# EAGLE design xbee-usb (EAGLE 7.5.0)
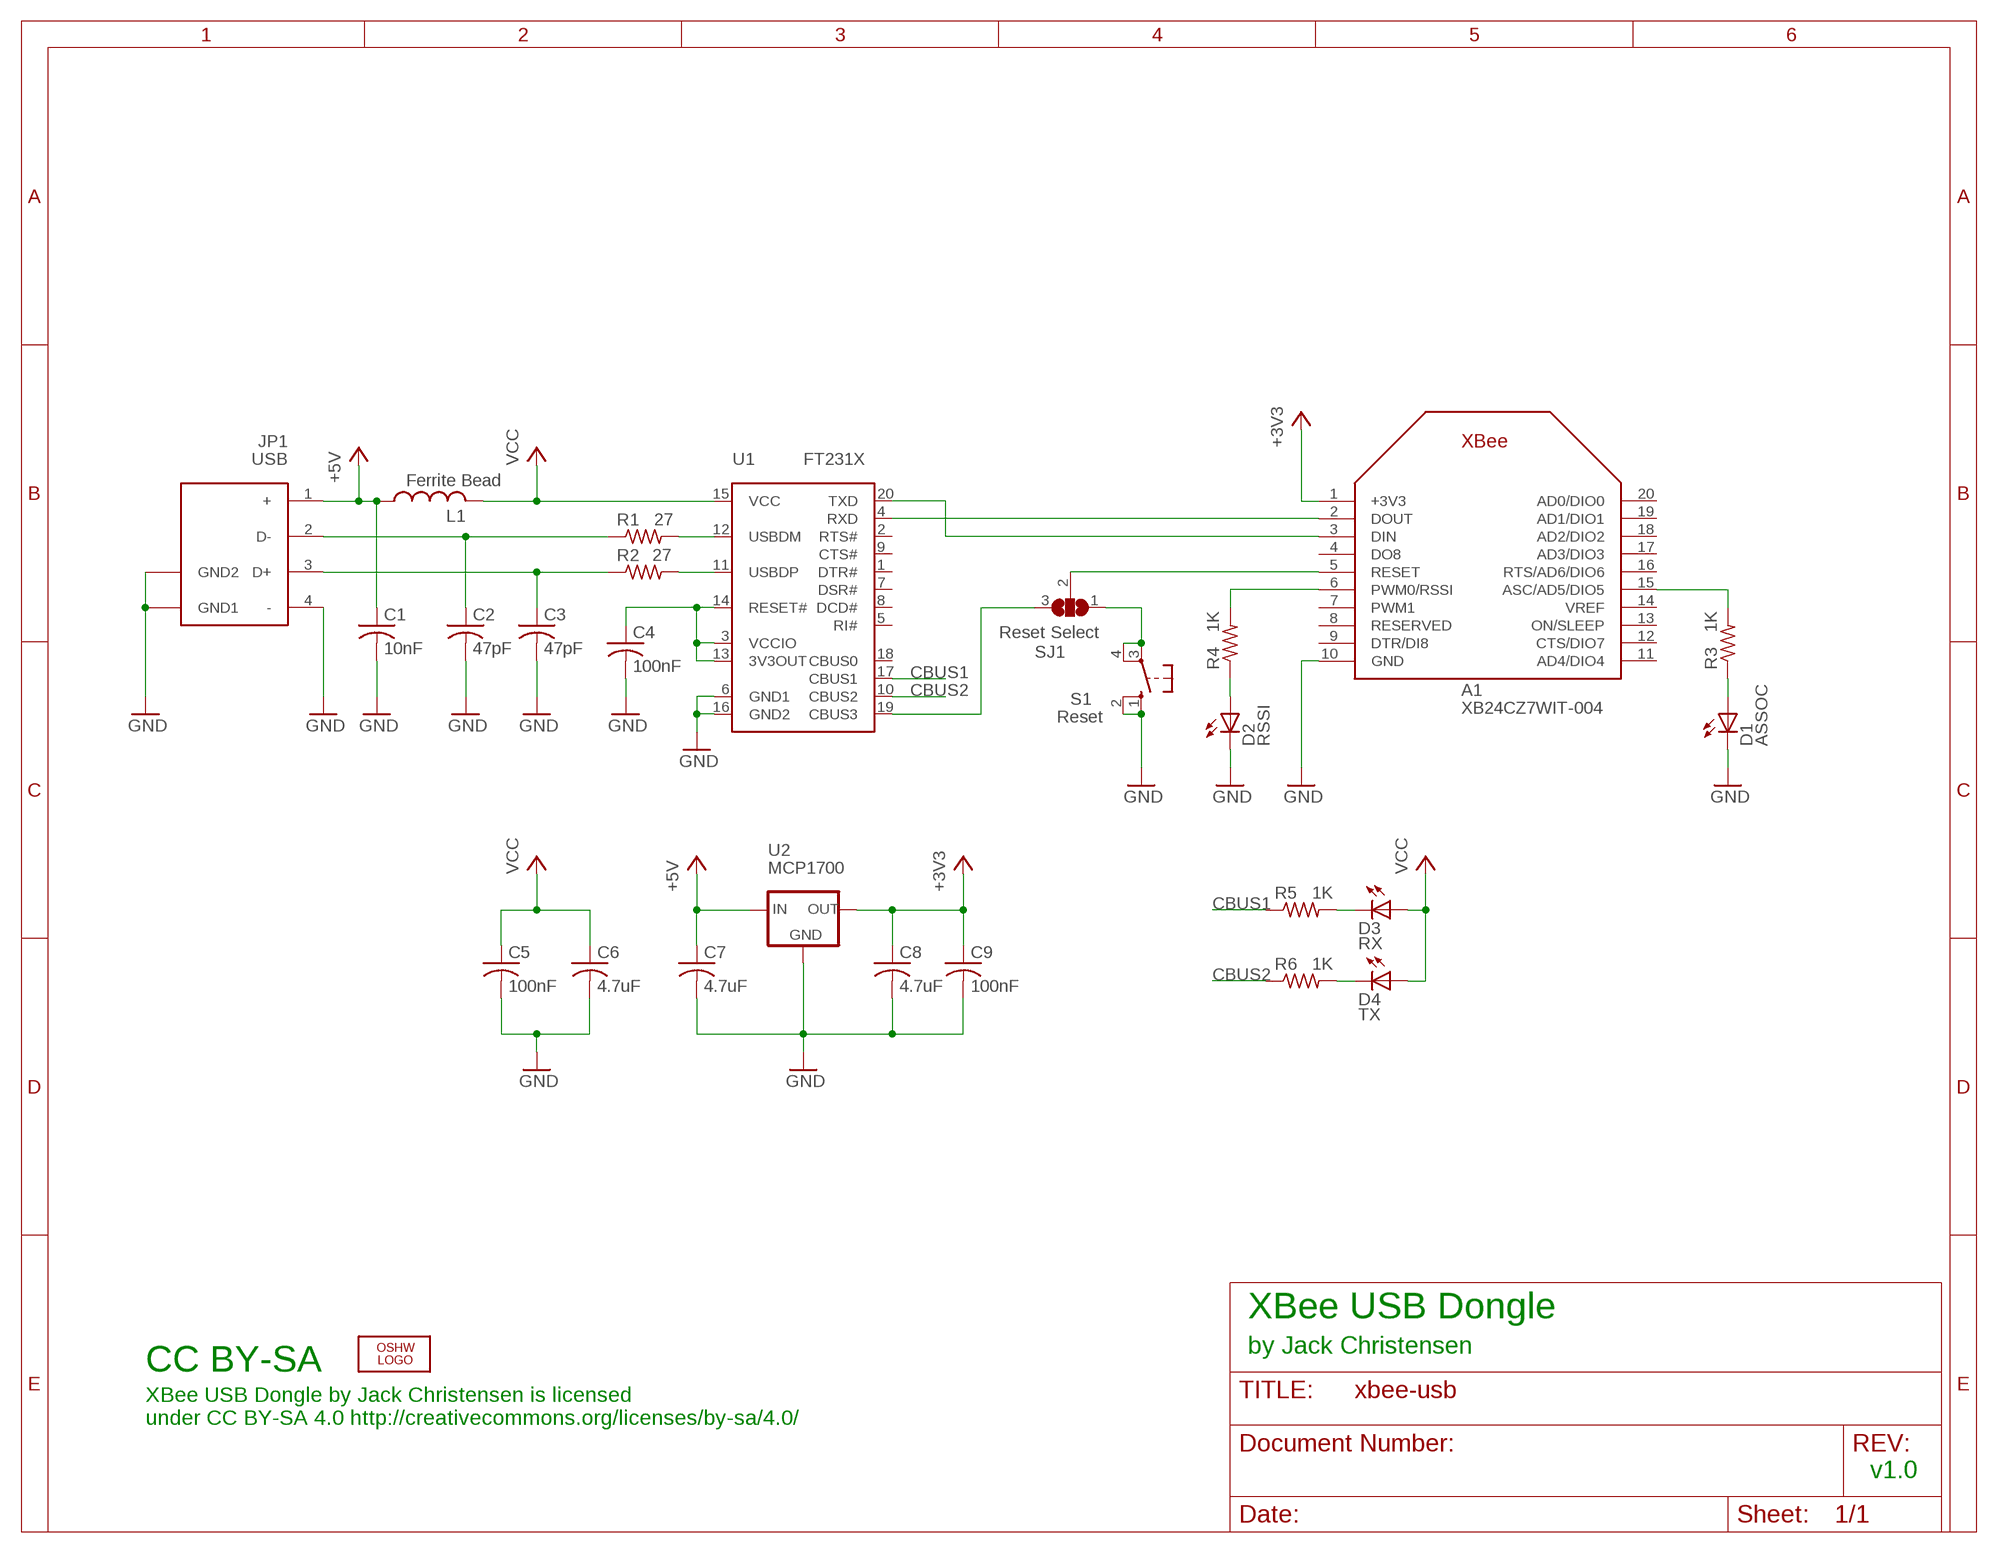
[diagram p0: schematic, sheet 1]

## Parts
A1  XB24CZ7WIT-004  ULINK_XBEEOVALPADS  [XBEE_OVAL_PADS]
C1  10nF  C-USM0805  [M0805]
C2  47pF  C-USM0805  [M0805]
C3  47pF  C-USM0805  [M0805]
C4  100nF  C-USM0805  [M0805]
C5  100nF  C-USM0805  [M0805]
C6  4.7uF  C-USM0805  [M0805]
C7  4.7uF  C-USM0805  [M0805]
C8  4.7uF  C-USM0805  [M0805]
C9  100nF  C-USM0805  [M0805]
D1  ASSOC  LEDD0805  [D0805]
D2  RSSI  LEDD0805A  [D0805A]
D3  RX  LEDD0805  [D0805]
D4  TX  LEDD0805A  [D0805A]
JP1  USB  UP2-AH-TH  [UP2-AH-X-TH]
L1  Ferrite Bead  INDUCTORM0805  [M0805]
LOGO1  OSHW_LOGO_8MILX0100-NT  [OSHW_8X100_NOTEXT]
R1  27  R-US_M0805  [M0805]
R2  27  R-US_M0805  [M0805]
R3  1K  R-US_M0805  [M0805]
R4  1K  R-US_M0805  [M0805]
R5  1K  R-US_M0805  [M0805]
R6  1K  R-US_M0805  [M0805]
S1  Reset  10-XXOCT  [B3F-10XXOCT]
SJ1  Reset Select  SJ2W  [SJ_2]
U1  FT231X  FT231XSSOP20-W  [SSOP20-W]
U2  MCP1700  MCP1700SOT23-W  [SOT23-W]

## Nets
+3V3: A1.1(+3V3) C8.1 C9.1 U2.2(OUT)
+5V: C1.1 C7.1 JP1.1(+) L1.1 U2.3(IN)
CBUS1: R5.1 U1.17(CBUS1)
CBUS2: R6.1 U1.10(CBUS2)
GND: A1.10(GND) C1.2 C2.2 C3.2 C4.2 C5.2 C6.2 C7.2 C8.2 C9.2 D1.K(C) D2.K(C) JP1.4(-) JP1.P$5(GND1) JP1.P$6(GND2) S1.1(S) S1.2(S1) U1.6(GND1) U1.16(GND2) U2.1(GND)
N$1: C2.1 JP1.2(D-) R1.1
N$2: C3.1 JP1.3(D+) R2.1
N$4: C4.1 U1.3(VCCIO) U1.13(3V3OUT) U1.14(RESET#)
N$5: R1.2 U1.12(USBDM)
N$6: R2.2 U1.11(USBDP)
N$7: A1.2(DOUT) U1.4(RXD)
N$8: A1.3(DIN) U1.20(TXD)
N$9: D3.K(C) R5.2
N$10: A1.5(RESET) SJ1.2
N$11: D2.A R4.1
N$12: D1.A R3.1
N$13: A1.6(PWM0/RSSI) R4.2
N$14: A1.15(ASC/AD5/DIO5) R3.2
N$15: D4.K(C) R6.2
N$16: S1.3(P) S1.4(P1) SJ1.1
N$19: SJ1.3 U1.19(CBUS3)
VCC: C5.1 C6.1 D3.A D4.A L1.2 U1.15(VCC)
Unconnected: A1.4(DO8) A1.7(PWM1) A1.8(RESERVED) A1.9(DTR/DI8) A1.11(AD4/DIO4) A1.12(CTS/DIO7) A1.13(ON/SLEEP) A1.14(VREF) A1.16(RTS/AD6/DIO6) A1.17(AD3/DIO3) A1.18(AD2/DIO2) A1.19(AD1/DIO1) A1.20(AD0/DIO0) U1.1(DTR#) U1.2(RTS#) U1.5(RI#) U1.7(DSR#) U1.8(DCD#) U1.9(CTS#) U1.18(CBUS0)

## Notes on the sheet
- XBee USB Dongle
- by Jack Christensen
- CC BY-SA
- XBee USB Dongle by Jack Christensen is licensed
  under CC BY-SA 4.0 http://creativecommons.org/licenses/by-sa/4.0/
- v1.0

## Library data of the parts
A1 = _jc:ULINK_XBEE
C1-C9 = _jc:C-US: CAPACITOR, American symbol
D1-D4 = _jc:LED: LED OSRAM: - CHIPLED LG R971, LG N971, LY N971, LG Q971, LY Q971, LO R971, LY R971 LH N974, LH R974 LS Q976, LO Q976, LY Q976 LO Q996 - Hyper CHIPLED LW Q18S LB Q993, LB Q99A, LB R99A - SideLED LS A670, LO A670, LY A670, LG A670, LP A670 LB A673, LV A673, LT A673, LW A673 LH A674 LY A675 LS A676, LA A676, LO A676, LY A676, LW A676 LS A679, LY A679, LG A679 - Hyper Micro SIDELED® LS Y876, LA Y876, LO Y876, LY Y876 LT Y87S - SmartLED LW L88C, LW L88S LB L89C, LB L89S, LG L890 LS L89K, LO L89K, LY L89K LS L896, LA L896, LO L896, LY L896 - TOPLED LS T670, LO T670, LY T670, LG T670, LP T670 LSG T670, LSP T670, LSY T670, LOP T670, LYG T670 LG T671, LOG T671, LSG T671 LB T673, LV T673, LT T673, LW T673 LH T674 LS T676, LA T676, LO T676, LY T676, LB T676, LH T676, LSB T676, LW T676 LB T67C, LV T67C, LT T67C, LS T67K, LO T67K, LY T67K, LW E67C LS E67B, LA E67B, LO E67B, LY E67B, LB E67C, LV E67C, LT E67C LW T67C LS T679, LY T679, LG T679 LS T770, LO T770, LY T770, LG T770, LP T770 LB T773, LV T773, LT T773, LW T773 LH T774 LS E675, LA E675, LY E675, LS T675 LS T776, LA T776, LO T776, LY T776, LB T776 LHGB T686 LT T68C, LB T68C - Hyper Mini TOPLED® LB M676 - Mini TOPLED Santana® LG M470 LS M47K, LO M47K, LY M47K Source: http://www.osram.convergy.de/
JP1 = _jc:UP2-AH-TH: CUI Inc. Series UP2-AH-TH Male USB plug.
L1 = _jc:INDUCTOR: Murata #11R472C
LOGO1 = ohw-logo:OSHW_LOGO_8MIL
R1-R6 = _jc:R-US_: RESISTOR, American symbol
S1 = _jc:10-XX: OMRON SWITCH
SJ1 = jumper:SJ2W: SMD solder JUMPER
U1 = _jc:FT231X: FTDI FT231X USB to Full Handshake UART IC
U2 = _jc:MCP1700: VOLTAGE REGULATOR

## Board
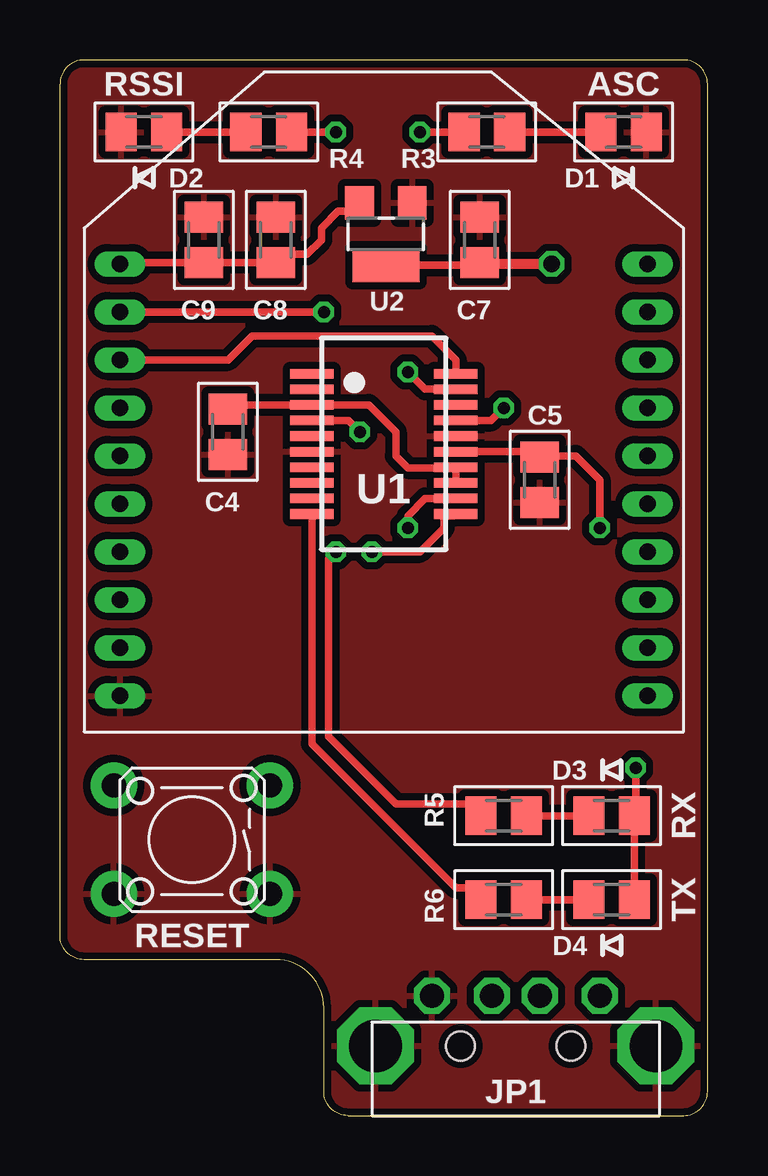
[diagram p1: board, top side]
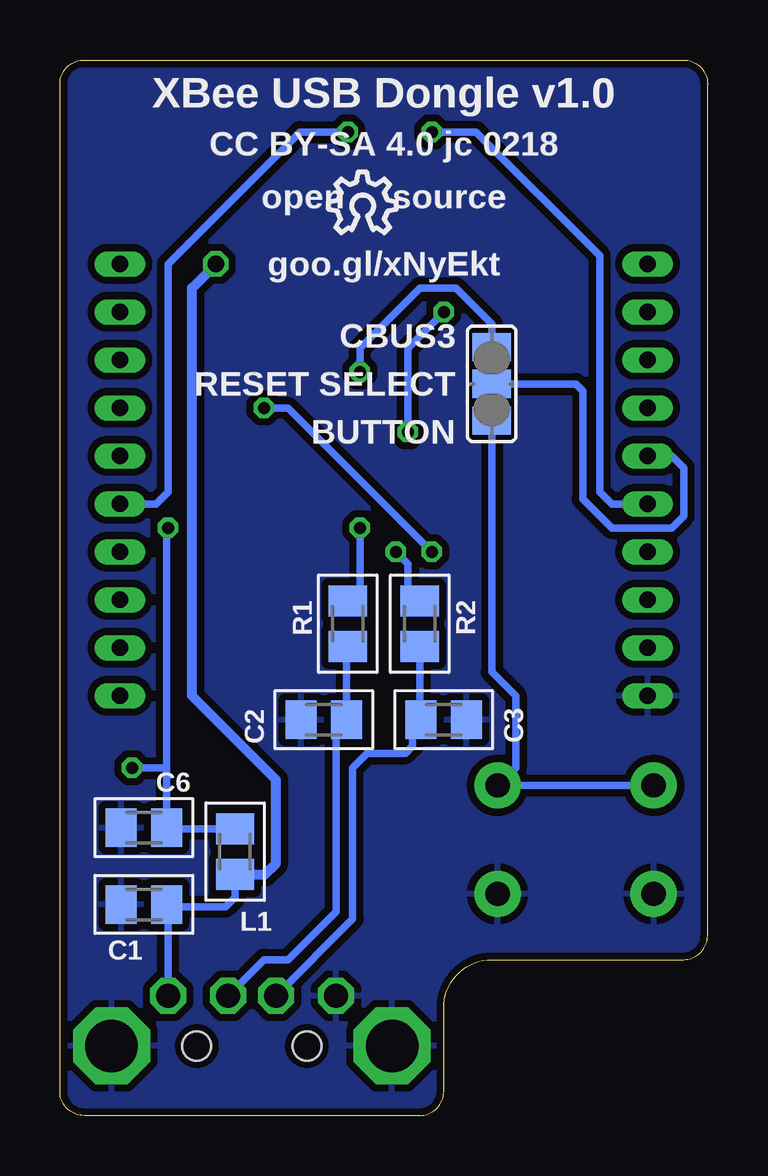
[diagram p2: board, bottom side, seen from below]

Size 27 x 44 mm. Coordinates in mm from the lower left corner, seen from the top.
Outline: 12,0 26,0 arc90 27,1 27,43 arc90 26,44 1,44 arc90 0,43 0,7.5 arc90 1,6.5 9,6.5 arc-90 11,4.5 11,1 arc90 12,0
Copper layers (1*16): Top 0.0356mm / dielectric 1.5011mm / Bottom 0.0356mm
Design rules "oshpark-2layer-jc": minimum track width 8mil, minimum drill 13mil, track to track 8mil, track to pad 8mil, pad to pad 8mil, via to via 8mil, smd to smd 6mil, copper to edge 12mil, drill to drill 6mil, minimum pad ring 7mil, minimum via ring 7mil, stop-mask expansion 2.5mil, vias tented up to drill 20mil, thermal gap 12mil

### Footprints (pad centres in the part's own frame; a part is rotated, then mirrored left to right if it is on the bottom)
XBEE_OVAL_PADS = drill 0.7 pad 1 long: 1 -11,5.5; 2 -11,3.5; 3 -11,1.5; 4 -11,-0.5; 5 -11,-2.5; 6 -11,-4.5; 7 -11,-6.5; 8 -11,-8.5; 9 -11,-10.5; 10 -11,-12.5; 11 11,-12.5; 12 11,-10.5; 13 11,-8.5; 14 11,-6.5; 15 11,-4.5; 16 11,-2.5; 17 11,-0.5; 18 11,1.5; 19 11,3.5; 20 11,5.5
M0805 = smd 1.3 x 1.6: 1 -0.95,0; 2 0.95,0
D0805 = smd 1.3 x 1.6: A -0.95,0; K 0.95,0
D0805A = smd 1.3 x 1.6: A -0.95,0; K 0.95,0
UP2-AH-X-TH = drill 1 octagon: 1 3.5,5; 2 1,5; 3 -1,5; 4 -3.5,5 | drill 2.2 octagon: P$5 5.85,2.9; P$6 -5.85,2.9 | hole 1.2: 2.3,2.9; -2.3,2.9
B3F-10XXOCT = drill 1.016 pad 1.93: 1 -3.251,2.261; 2 3.251,2.261; 3 -3.251,-2.261; 4 3.251,-2.261
SJ_2 = smd 1.168 x 1.6: 1 -1.524,0; 2 0,0; 3 1.524,0
SSOP20-W = smd 0.4 x 1.8: 1 -2.925,-3; 2 -2.275,-3; 3 -1.625,-3; 4 -0.975,-3; 5 -0.325,-3; 6 0.325,-3; 7 0.975,-3; 8 1.625,-3; 9 2.275,-3; 10 2.925,-3; 11 2.925,3; 12 2.275,3; 13 1.625,3; 14 0.975,3; 15 0.325,3; 16 -0.325,3; 17 -0.975,3; 18 -1.625,3; 19 -2.275,3; 20 -2.925,3
SOT23-W = smd 1.2 x 1.4: 1 -1.1,-1.3; 2 1.1,-1.3 | smd 2.8 x 1.4: 3 0,1.3

### Placement (x,y rotation side)
A1  13.5,30 0 top
C1  23.5,8.8 180 bottom
C2  16,16.5 180 bottom
C3  11,16.5 0 bottom
C4  7,28.5 270 top
C5  20,26.5 270 top
C6  23.5,12 180 bottom
C7  17.5,36.5 90 top
C8  9,36.5 90 top
C9  6,36.5 90 top
D1  23.5,41 0 top
D2  3.5,41 180 top
D3  23,12.5 180 top
D4  23,9 180 top
JP1  19,0 0 top
L1  19.7,11 90 bottom
LOGO1  15.8,36.8 0 bottom
R1  15,20.5 90 bottom
R2  12,20.5 90 bottom
R3  17.8,41 180 top
R4  8.7,41 0 top
R5  18.5,12.5 0 top
R6  18.5,9 0 top
S1  5.5,11.5 180 top
SJ1  9,30.5 90 bottom
U1  13.5,28 270 top
U2  13.59,36.75 180 top

### Tracks (layer width: path | path; a pad name or v marks a point on that pad's centre or on a via)
+3V3
  Top 0.305: U2.2 12.14,37.7 11.6,37.7 10.9,37 10.9,36.5 10.3,35.9 9.5,35.9 9.5,36 9.05,35.55 C8.1 C9.1 2.55,35.55 A1.1
+5V  (via drill 0.7)
  Top 0.305: U2.3 17.4,35.45 C7.1
  Top 0.406: v20.5,35.5 17.55,35.5 C7.1
  Bottom 0.305: JP1.1 22.5,8.75 C1.1 22.45,8.7 20.1,8.7 19.7,9.1 L1.1
  Bottom 0.406: L1.1 18.45,10.05 18,10.5 18,14 21.5,17.5 21.5,34.5 v20.5,35.5
CBUS1  (via drill 0.5)
  Top 0.305: U1.17 17.98,28.98 v18.5,29.5 | v11.5,23.5 11.2,23.2 11.2,15.8 14,13 17.05,13 R5.1
  Bottom 0.305: v11.5,23.5 17.5,29.5 v18.5,29.5
CBUS2
  Top 0.305: U1.10 10.5,15.5 16.5,9.5 17.05,9.5 R6.1
GND
  pour Top (isolate 0.305): -1,-2 -1,45 28,45 28,-2
  pour Bottom (isolate 0.305): -2,46 29,46 29,-3 -2,-3
N$1
  Bottom 0.305: R1.1 15.05,19.5 C2.1 15.5,16.05 15.5,8.5 17.5,6.5 18.5,6.5 JP1.2
N$2
  Bottom 0.305: R2.1 12,16.55 C3.1 11.95,16.45 12.3,16.1 12.3,15.4 12.6,15.1 14.2,15.1 14.8,14.5 14.8,8.2 JP1.3
N$4
  Top 0.305: U1.13 U1.14 16.48,27 14.5,27 14,27.5 14,28.5 12.88,29.62 U1.3 7.17,29.62 C4.1
N$5  (via drill 0.5)
  Top 0.305: U1.12 15.22,25.73 14.5,25 v14.5,24.5
  Bottom 0.305: v14.5,24.5 14.5,21.95 R1.2
N$6  (via drill 0.5)
  Top 0.305: v13,23.5 15,23.5 16,24.5 16,25 16.43,25 U1.11
  Bottom 0.305: v13,23.5 12.5,23 12.5,21.95 R2.2
N$7  (via drill 0.5)
  Top 0.305: U1.4 12.03,28.98 v12.5,28.5 | v11,33.5 A1.2
  Bottom 0.305: v12.5,28.5 12.5,32 v11,33.5
N$8
  Top 0.305: A1.3 7,31.5 8,32.5 15.5,32.5 16.5,31.5 U1.20
N$9
  Top 0.305: D3.K R5.2
N$10
  Bottom 0.305: SJ1.2 5.5,30.5 5.2,30.2 5.2,25.7 4,24.5 1.5,24.5 1,25 1,27 1.5,27.5 A1.5
N$11
  Top 0.305: D2.A R4.1
N$12
  Top 0.305: R3.1 D1.A
N$13  (via drill 0.5)
  Top 0.305: v11.5,41 R4.2
  Bottom 0.305: A1.6 4,25.5 4.5,26 4.5,35.85 R4.2 v11.5,41
N$14  (via drill 0.5)
  Top 0.305: v15,41 R3.2
  Bottom 0.305: A1.15 23,25.5 22.5,26 22.5,35.5 17,41 v15,41
N$15
  Top 0.305: D4.K R6.2
N$16
  Bottom 0.305: SJ1.1 9,18.5 8,17.5 8,14.5 S1.3 S1.4
N$19  (via drill 0.5)
  Top 0.305: U1.19 15.22,30.27 v14.5,31
  Bottom 0.305: v14.5,31 14.5,32 12,34.5 10.5,34.5 9,33 SJ1.3
VCC  (via drill 0.5)
  Top 0.305: D4.A D3.A 24,12.55 v24,14.5 | v22.5,24.5 22.5,26.5 21.5,27.5 20.05,27.5 C5.1 19.77,27.68 U1.15
  Bottom 0.305: L1.2 22.5,11.95 C6.1 22.55,14.5 | v22.5,24.5 22.55,24.45 22.55,14.5 | v24,14.5 22.55,14.5

### Text on the board
tPlace: RSSI | ASC | RX | TX | RESET
bPlace: XBee USB Dongle v1.0 | CC BY-SA 4.0 jc 0218 | open source | goo.gl/xNyEkt | CBUS3 | RESET SELECT | BUTTON